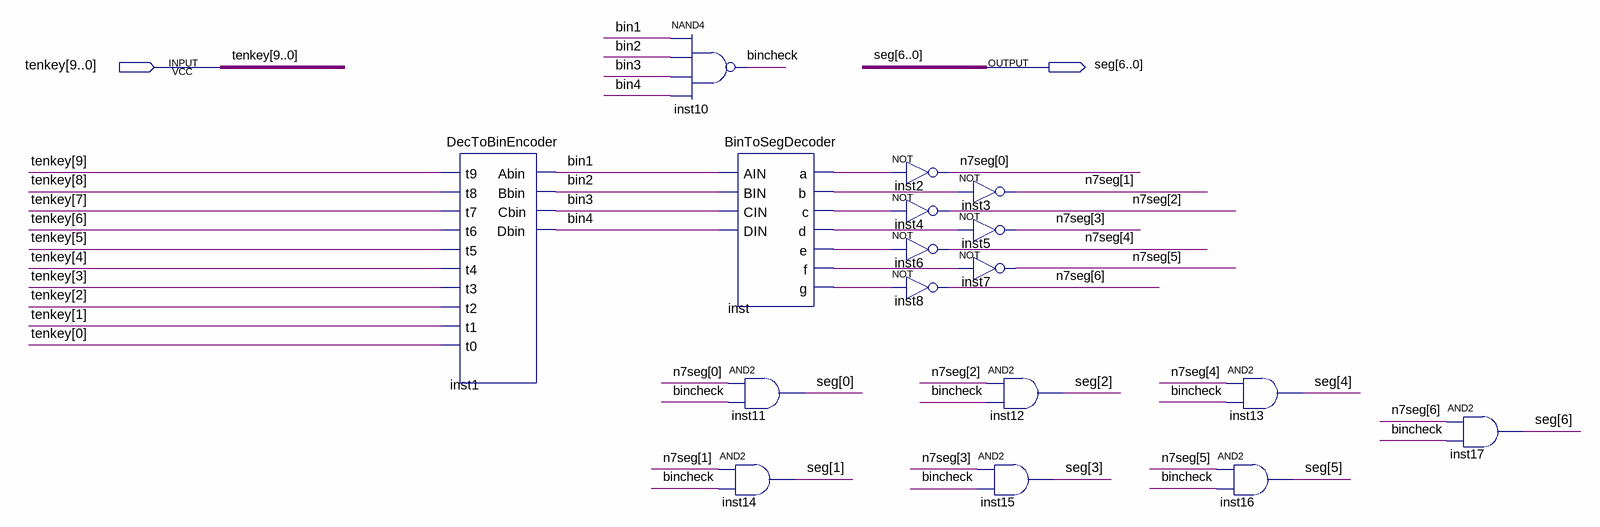
[diagram p0: schematic sheet]
// Quartus schematic DecToSegModule.bdf as structural Verilog: 17 symbols, 2 pins
module DecToSegModule (
  input  [9:0] tenkey,
  output [6:0] seg
);

  wire bin1, bin2, bin3, bin4, bincheck, inst_a, inst_b, inst_c, inst_d, inst_e, inst_f, inst_g;
  wire [6:0] n7seg;

  DecToBinEncoder inst1 (
    .t9(tenkey[9]), .t8(tenkey[8]), .t7(tenkey[7]), .t6(tenkey[6]), .t5(tenkey[5]), .t4(tenkey[4]),
    .t3(tenkey[3]), .t2(tenkey[2]), .t1(tenkey[1]), .t0(tenkey[0]), .Abin(bin1), .Bbin(bin2), .Cbin(bin3),
    .Dbin(bin4));
  nand inst10 (bincheck, bin1, bin2, bin3, bin4);
  BinToSegDecoder inst (
    .AIN(bin1), .BIN(bin2), .CIN(bin3), .DIN(bin4), .a(inst_a), .b(inst_b), .c(inst_c), .d(inst_d),
    .e(inst_e), .f(inst_f), .g(inst_g));
  and inst11 (seg[0], n7seg[0], bincheck);
  and inst14 (seg[1], n7seg[1], bincheck);
  not inst2 (n7seg[0], inst_a);
  not inst4 (n7seg[2], inst_c);
  not inst6 (n7seg[4], inst_e);
  not inst8 (n7seg[6], inst_g);
  not inst3 (n7seg[1], inst_b);
  not inst5 (n7seg[3], inst_d);
  not inst7 (n7seg[5], inst_f);
  and inst12 (seg[2], n7seg[2], bincheck);
  and inst15 (seg[3], n7seg[3], bincheck);
  and inst13 (seg[4], n7seg[4], bincheck);
  and inst16 (seg[5], n7seg[5], bincheck);
  and inst17 (seg[6], n7seg[6], bincheck);
endmodule
